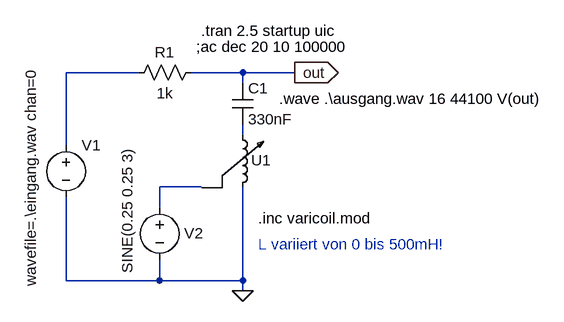
[diagram p0: schematic varicoil.asc]
varicoil.asc, the LTspice schematic file:
Version 4
SHEET 1 2056 680
WIRE -48 -112 -160 -112
WIRE 112 -112 32 -112
WIRE 192 -112 112 -112
WIRE 112 -96 112 -112
WIRE 112 -16 112 -32
WIRE -160 0 -160 -112
WIRE 48 64 -16 64
WIRE -16 96 -16 64
WIRE -160 208 -160 80
WIRE -16 208 -16 176
WIRE -16 208 -160 208
WIRE 112 208 112 64
WIRE 112 208 -16 208
WIRE 112 224 112 208
FLAG 112 224 0
FLAG 192 -112 out
IOPIN 192 -112 Out
SYMBOL voltage -16 80 R0
WINDOW 0 38 55 Left 0
WINDOW 123 0 0 Left 0
WINDOW 39 0 0 Left 0
WINDOW 3 -50 -76 VRight 0
SYMATTR InstName V2
SYMATTR Value SINE(0.25 0.25 3)
SYMBOL res 48 -128 R90
WINDOW 0 0 56 VBottom 0
WINDOW 3 32 56 VTop 0
SYMATTR InstName R1
SYMATTR Value 1k
SYMBOL voltage -160 -16 R0
WINDOW 3 -54 -104 VRight 0
WINDOW 123 0 0 Left 0
WINDOW 39 0 0 Left 0
SYMATTR Value wavefile=.\eingang.wav chan=0
SYMATTR InstName V1
SYMBOL cap 96 -96 R0
SYMATTR InstName C1
SYMATTR Value 330nF
SYMBOL varicoil 96 -32 R0
SYMATTR InstName U1
SYMATTR SpiceModel varicoil
TEXT 48 -176 Left 0 !.tran 2.5 startup uic
TEXT 136 112 Left 0 !.inc varicoil.mod
TEXT 168 -72 Left 0 !.wave .\\ausgang.wav 16 44100 V(out)
TEXT 40 -152 Left 0 !;ac dec 20 10 100000
TEXT 136 152 Left 0 ;L variiert von 0 bis 500mH!

The netlist it stands for:
* varicoil.asc
V2 N003 0 SINE(0.25 0.25 3)
R1 out N001 1k
V1 N001 0 wavefile=.\eingang.wav chan=0
C1 out N002 330nF
XU1 N002 0 N003 varicoil  ; pins A B CTRL
.tran 2.5 startup uic
.inc varicoil.mod
.wave .\ausgang.wav 16 44100 V(out)
;ac dec 20 10 100000
* L variiert von 0 bis 500mH!
.backanno
.end